# Altium project AES17Filter.PrjPcb
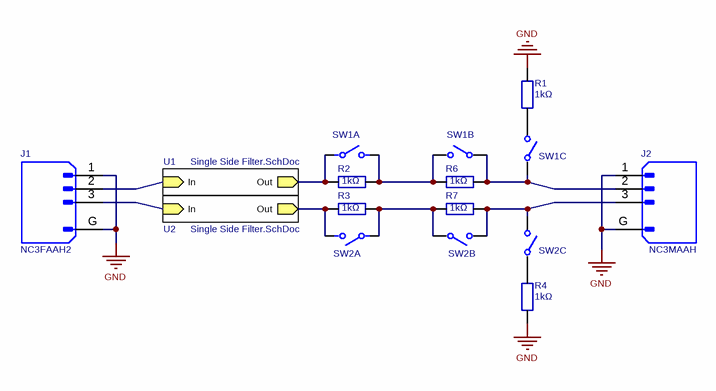
[diagram p0: AES17Filter.SchDoc]
Project: AES17 / Class-D-Filter; HWRev: V1.0; DrawnBy: David
2 sheets, 34 parts. Net scope: hierarchical (ports join the sheet entries above them; power ports are global).
Board file: AES17Filter.PcbDoc
Sheets:
  AES17Filter.SchDoc
    U1 = Single Side Filter.SchDoc
    U2 = Single Side Filter.SchDoc

## Sheet AES17Filter.SchDoc: Overview
size 287 x 198 mm; DrawnBy: David; DocumentNumber: 1; Revision: 1.0; SheetNumber: 1; SheetTotal: 2

### Parts
J1  MPN: NC3FAAH2  [NEUTRIK_NC3FAAH2]
J2  (no value)  [NEUTRIK_NC3MAAH]
R1  value 1kΩ  [RESC6432X06N]
R2  value 1kΩ  [RESC6432X06N]
R3  value 1kΩ  [RESC6432X06N]
R4  value 1kΩ  [RESC6432X06N]
R6  value 1kΩ  [RESC6432X06N]
R7  value 1kΩ  [RESC6432X06N]
SW1  (no value)  [FP-A6S-3101-H-MFG]  (parts A,B,C of 3)
SW2  (no value)  [FP-A6S-3101-H-MFG]  (parts A,B,C of 3)

### Sub-sheets
U1 = Single Side Filter.SchDoc: Out (out), In (in)
U2 = Single Side Filter.SchDoc: Out (out), In (in)

### Nets
GND: J1.1 J1.G J2.1 J2.G R1.2 R4.2
NetJ1_2: J1.2 ; sheet U1/In
NetJ1_3: J1.3 ; sheet U2/In
NetJ2_2: J2.2 R6.2 SW1.2 SW1.3
NetJ2_3: J2.3 R7.2 SW2.4 SW2.5
NetR1_1: R1.1 SW1.4
NetR2_1: R2.1 SW1.1 ; sheet U1/Out
NetR2_2: R2.2 R6.1 SW1.5 SW1.6
NetR3_1: R3.1 R7.1 SW2.1 SW2.2
NetR3_2: R3.2 SW2.6 ; sheet U2/Out
NetR4_1: R4.1 SW2.3

### Notes on the sheet
- Redako
- Keilestraat 5a, 3029BP, Rotterdam, M: david@redako.nl, T: +31 6 16001008
- Project
- Title
- Customer
- Size:
- Date:
- File:
- A4
- Revision:
- Time:
- Drawn by:
- GIT Revision:
- Sheet:
- of

### Library data of the parts
J1 J2 = NC3MAAH: 3 pole male XLR receptacle, grounding: separate ground contact to mating connector shell and front panel, horizontal PCB mount; Value: *
  J2: MPN: NC3MAAH
R1-R4 R6 R7 = Res: Tolerance: 1%; Rating: 200V; Package: 2512
SW1 SW2 = CMP-08827-000069-1: SWITCH SLIDE DIP SPST 25MA 24V; MPN: A6S-3101-H

## Sheet Single Side Filter.SchDoc
size 287 x 198 mm; SheetNumber: 2; SheetTotal: 2
Used 2 times, as channels U1, U2. Parts and nets are listed once, with the designators drawn on the sheet.
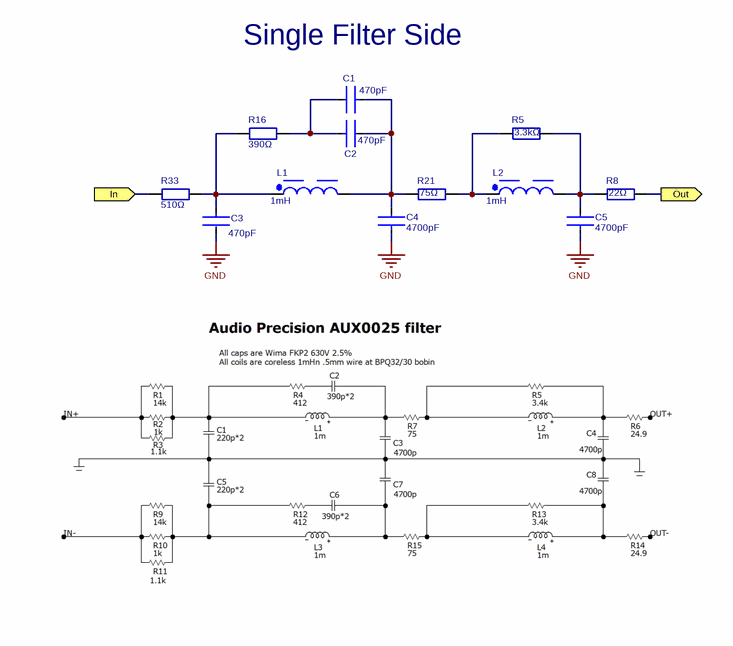
[diagram p1: Single Side Filter.SchDoc]

### Parts
C1  value 470pF  [Film Capacitor 7.2 x 4.5 x 6.0 mm]
C2  value 470pF  [Film Capacitor 7.2 x 4.5 x 6.0 mm]
C3  value 470pF  [Film Capacitor 7.2 x 4.5 x 6.0 mm]
C4  value 4700pF  [Film Capacitor 7.2 x 6.5 x 8.0 mm]
C5  value 4700pF  [Film Capacitor 7.2 x 6.5 x 8.0 mm]
L1  value 1mH  [WE-PD HV_1210]
L2  value 1mH  [WE-PD HV_1210]
R5  value 3.3kΩ  [RESC6432X06N]
R8  value 22Ω  [RESC6432X06N]
R16  value 390Ω  [RESC6432X06N]
R21  value 75Ω  [RESC6432X06N]
R33  value 510Ω  [RESC6432X06N]

### Ports
In (in), Out (out)

### Nets
GND: C3.2 C4.1 C5.1
In: R33.1 ; port In
Out: R8.2 ; port Out
NetC1_1: C1.1 C2.2 C4.2 L1.2 R21.1
NetC1_2: C1.2 C2.1 R16.2
NetC3_1: C3.1 L1.1 R16.1 R33.2
NetC5_2: C5.2 L2.2 R5.2 R8.1
NetL2_1: L2.1 R5.1 R21.2

### Channels
U1: designators end in _U1; ports In=NetJ1_2 Out=NetR2_1
U2: designators end in _U2; ports In=NetJ1_3 Out=NetR3_2

### Notes on the sheet
- (near C1) Single Filter Side
- Redako
- Keilestraat 5a, 3029BP, Rotterdam, M: david@redako.nl, T: +31 6 16001008
- Project
- Title
- Customer
- Size:
- Date:
- File:
- A4
- Revision:
- Time:
- Drawn by:
- GIT Revision:
- Sheet:
- of

### Library data of the parts
C1-C3 = b4654b650e69147ec39a6b967a45e02: PFR5102F100J11L4BULK Cap Film 0.001uF 100V PP 1% (7.2 X 4.5 X 6mm) Radial 5mm 100C Bulk; MPN: FKP2J004701D00HS; Tolerance: 2.5%; Rating: 630V; Package: 7.2 x 6.5 x 8mm
C4 C5 = b4654b650e69147ec39a6b967a45e02: PFR5102F100J11L4BULK Cap Film 0.001uF 100V PP 1% (7.2 X 4.5 X 6mm) Radial 5mm 100C Bulk; MPN: FKP2J014701I00HS; Tolerance: 2.5%; Rating: 630V; Package: 7.2 x 4.5 x 6mm
L1 L2 = CMP-1387-00011-6: MPN: MSS1278T-105 / 7687709102; Tolerance: 10%; Rating: 1A
R5 R8 R16 R21 R33 = Res: Tolerance: 1%; Rating: 200V; Package: 2512

## Nets that join several sheets
GND: AES17Filter (6 pins), U1 (C3_U1.2 C4_U1.1 C5_U1.1), U2 (C3_U2.2 C4_U2.1 C5_U2.1)
NetJ1_2: AES17Filter (J1.2), U1 (R33_U1.1)
NetJ1_3: AES17Filter (J1.3), U2 (R33_U2.1)
NetR2_1: AES17Filter (R2.1 SW1.1), U1 (R8_U1.2)
NetR3_2: AES17Filter (R3.2 SW2.6), U2 (R8_U2.2)

## Assembly variants
Default: not fitted H1 H5 H6 H7
MVP: all parts fitted